# Altium schematic sheet Breakout.SchDoc
size A4; DocumentNumber: 1; SheetNumber: 1
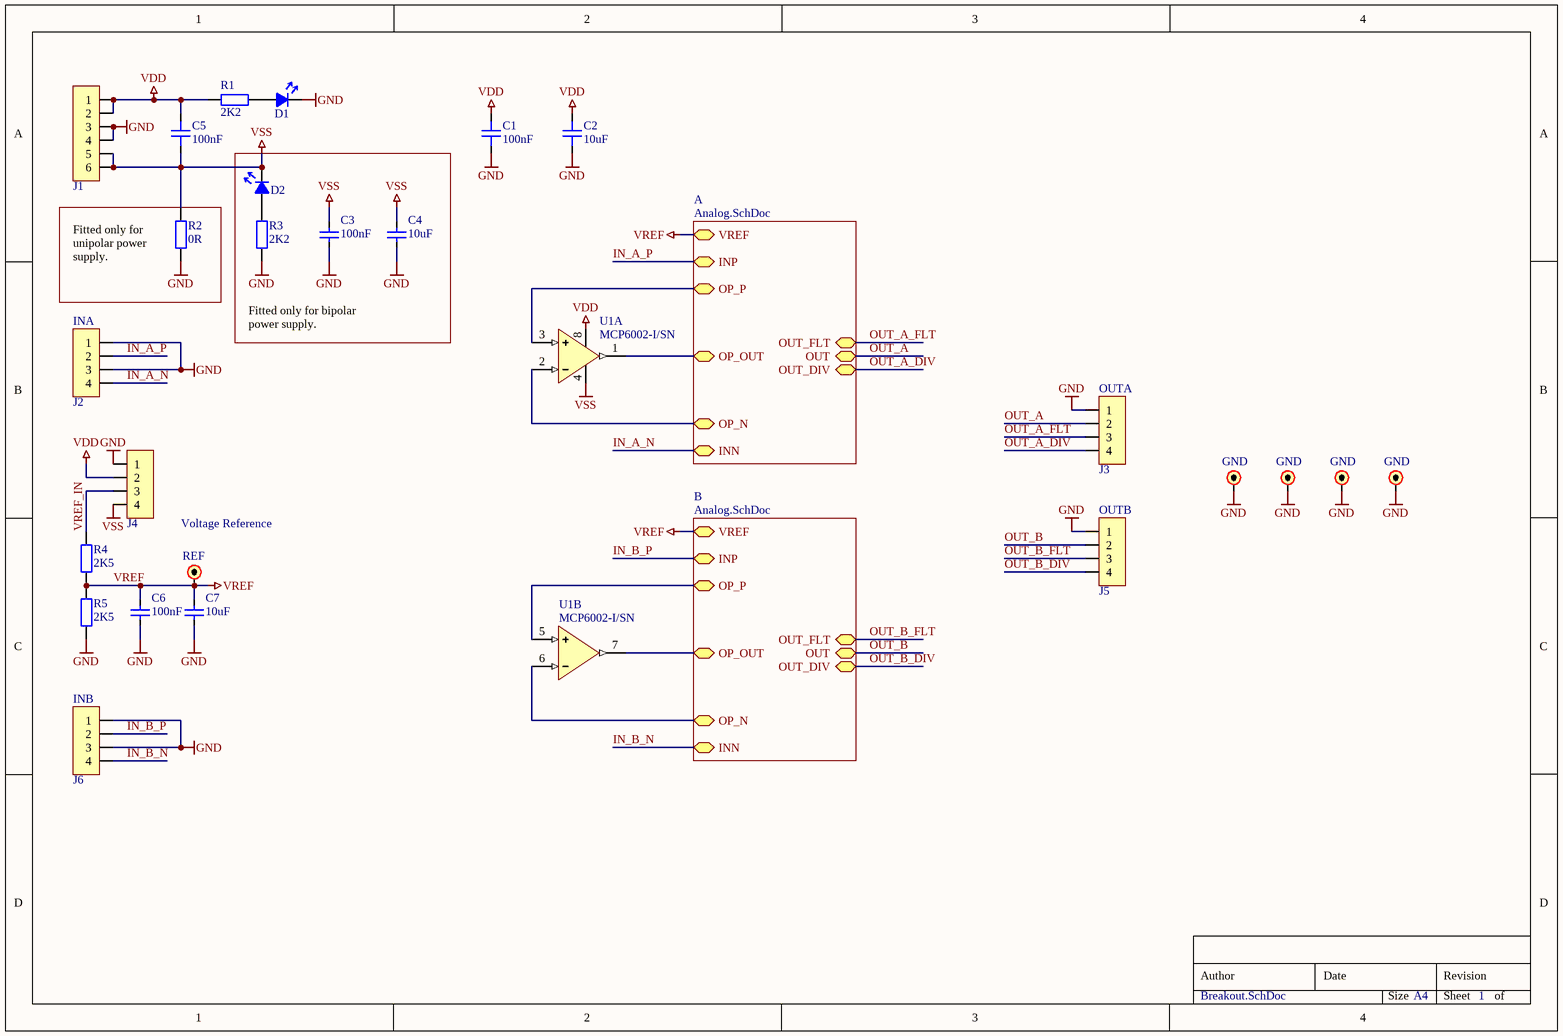
[diagram p0: Breakout.SchDoc]

## Parts
C1  100nF  [0805C_RF_M]
C2  10uF  [0805C_RF_M]
C3  100nF  [0805C_RF_M]
C4  10uF  [0805C_RF_M]
C5  100nF  [0805C_RF_M]
C6  100nF  [0805C_RF_M]
C7  10uF  [0805C_RF_M]
D1  Unspecified  [0805LED_RF_M]  (value not drawn)
D2  Unspecified  [0805LED_RF_M]  (value not drawn)
J1  PINHDR-6P1  [HEADER-2.54-6P1]  (value not drawn)
J2  INA  [HEADER-2.54-4P1]
J3  OUTA  [HEADER-2.54-4P1]
J4  PINHDR-4P1  [HEADER-2.54-4P1]  (value not drawn)
J5  OUTB  [HEADER-2.54-4P1]
J6  INB  [HEADER-2.54-4P1]
R1  2K2  [0805R_RF_M]
R2  0R  [0805R_RF_M]
R3  2K2  [0805R_RF_M]
R4  2K5  [0805R_RF_M]
R5  2K5  [0805R_RF_M]
TP1  GND  [PAD_R_1.5MM]
TP2  GND  [PAD_R_1.5MM]
TP3  GND  [PAD_R_1.5MM]
TP4  GND  [PAD_R_1.5MM]
TP10  REF  [PAD_R_1.5MM]
U1  MCP6002-I/SN  [SOIC-8]  (parts A,B of 2)

## Sub-sheets
A = Analog.SchDoc: OP_OUT, VREF, OUT_FLT, OP_P, OUT, OUT_DIV, INN, INP, OP_N
B = Analog.SchDoc: OP_OUT, VREF, OUT_FLT, OP_P, OUT, OUT_DIV, INN, INP, OP_N

## Nets
GND: C1.1 C2.1 C3.1 C4.1 C6.1 C7.1 D1.C J1.3 J1.4 J2.1 J2.3 J3.1 J4.1 J5.1 J6.1 J6.3 R2.1 R3.2 R5.1 TP1.1 TP2.1 TP3.1 TP4.1
VDD: C1.2 C2.2 C5.2 J1.1 J1.2 J4.2 R1.1 U1.8
VREF: C6.2 C7.2 R4.1 R5.2 TP10.1 ; sheet A/VREF, sheet B/VREF
VSS: C3.2 C4.2 C5.1 D2.C J1.5 J1.6 J4.4 R2.2 U1.4
IN_A_N: J2.4 ; sheet A/INN
IN_A_P: J2.2 ; sheet A/INP
IN_B_N: J6.4 ; sheet B/INN
IN_B_P: J6.2 ; sheet B/INP
OUT_A: J3.2 ; sheet A/OUT
OUT_A_DIV: J3.4 ; sheet A/OUT_DIV
OUT_A_FLT: J3.3 ; sheet A/OUT_FLT
OUT_B: J5.2 ; sheet B/OUT
OUT_B_DIV: J5.4 ; sheet B/OUT_DIV
OUT_B_FLT: J5.3 ; sheet B/OUT_FLT
VREF_IN: J4.3 R4.2
NetD1_A: D1.A R1.2
NetD2_A: D2.A R3.1
NetU1_1: U1.1 ; sheet A/OP_OUT
NetU1_2: U1.2 ; sheet A/OP_N
NetU1_3: U1.3 ; sheet A/OP_P
NetU1_5: U1.5 ; sheet B/OP_P
NetU1_6: U1.6 ; sheet B/OP_N
NetU1_7: U1.7 ; sheet B/OP_OUT

## Notes on the sheet
- (near R2) Fitted only for unipolar power supply.
- Fitted only for bipolar power supply.
- Voltage Reference
- Author
- Date
- Revision
- Size
- A4
- Sheet
- of

## Library data of the parts
C1-C7 = C: Capacitor; Manufacturer: Generic Brand; Max Voltage: ? V; Tolerance: ?; Mounting Technology: SMT; Tag: *; Manufacturer Part No: *; Supplier: *; Supplier Link: http://; Supplier Part No: *; Category: Capacitor
  C1 C3 C5 C6: Value: 100nF
  C2 C4 C7: Value: 10uF
D1 D2 = LED: Manufacturer: Generic Brand; Forward Voltage Drop: ? V; Emitting Color: Unspecified; Manufacturer Part No: *; Supplier: *; Supplier Link: http://; Supplier Part No: *; Category: Diode; Mounting Technology: SMT
J1 = PINHDR-6P1: Pin Header Single Row 6 Positions; Mounting Technology: THT
J2-J6 = PINHDR-4P1: Generic Pin Header 4x1
R1-R5 = R: Resistor; Manufacturer: Generic Brand; Power Rating: ? W; Max Voltage: ? V; Tolerance: ?; Supplier Link: http://; Category: Resistor; Mounting Technology: SMT
  R1 R3: Value: 2K2
  R2: Value: 0R
  R4 R5: Value: 2K5
TP1-TP4 TP10 = Test Point: Test Point / Pad
U1 = MCP6002-I/SN: IC OPAMP GP 2 CIRCUIT 8SOIC; DIGIKEY_PART_NO: MCP6002-I/SN-ND; DIGIKEY_URL: https://www.digikey.com/en/products/detail/microchip-technology/MCP6002-I-SN/500876; DIGIKEY_UNIT_PRICE: $0.33